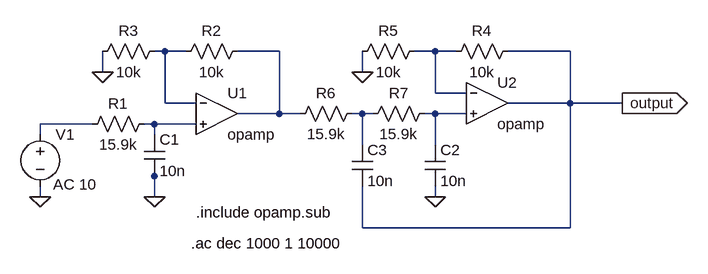
[diagram p0: schematic simulation_ltspice.asc]
simulation_ltspice.asc, the LTspice schematic file:
Version 4.1
SHEET 1 984 680
WIRE 144 -272 128 -272
WIRE 176 -272 144 -272
WIRE 320 -272 256 -272
WIRE 560 -272 528 -272
WIRE 592 -272 560 -272
WIRE 768 -272 672 -272
WIRE 48 -240 48 -272
WIRE 448 -240 448 -272
WIRE 560 -208 560 -272
WIRE 608 -208 560 -208
WIRE 144 -192 144 -272
WIRE 192 -192 144 -192
WIRE 768 -192 768 -272
WIRE 768 -192 672 -192
WIRE 848 -192 768 -192
WIRE 320 -176 320 -272
WIRE 320 -176 256 -176
WIRE 352 -176 320 -176
WIRE 448 -176 432 -176
WIRE 464 -176 448 -176
WIRE 560 -176 544 -176
WIRE 608 -176 560 -176
WIRE 32 -160 -48 -160
WIRE 128 -160 112 -160
WIRE 192 -160 128 -160
WIRE -48 -144 -48 -160
WIRE 128 -144 128 -160
WIRE 448 -128 448 -176
WIRE 560 -128 560 -176
WIRE 128 -80 128 -96
WIRE -48 -48 -48 -64
WIRE 128 -48 128 -80
WIRE 560 -48 560 -64
WIRE 448 0 448 -64
WIRE 768 0 768 -192
WIRE 768 0 448 0
FLAG 48 -240 0
FLAG 128 -48 0
FLAG -48 -48 0
FLAG 560 -48 0
FLAG 448 -240 0
FLAG 848 -192 output
IOPIN 848 -192 Out
SYMBOL OpAmps\\opamp 224 -240 R0
SYMATTR InstName U1
SYMBOL res 128 -176 R90
WINDOW 0 0 56 VBottom 2
WINDOW 3 32 56 VTop 2
SYMATTR InstName R1
SYMATTR Value 15.9k
SYMBOL cap 112 -144 R0
SYMATTR InstName C1
SYMATTR Value 10n
SYMBOL res 272 -288 R90
WINDOW 0 0 56 VBottom 2
WINDOW 3 32 56 VTop 2
SYMATTR InstName R2
SYMATTR Value 10k
SYMBOL res 144 -288 R90
WINDOW 0 0 56 VBottom 2
WINDOW 3 32 56 VTop 2
SYMATTR InstName R3
SYMATTR Value 10k
SYMBOL voltage -48 -160 R0
WINDOW 123 20 93 Left 2
WINDOW 39 0 0 Left 0
SYMATTR InstName V1
SYMATTR Value ""
SYMATTR Value2 AC 10
SYMBOL OpAmps\\opamp 640 -256 R0
SYMATTR InstName U2
SYMBOL res 688 -288 R90
WINDOW 0 0 56 VBottom 2
WINDOW 3 32 56 VTop 2
SYMATTR InstName R4
SYMATTR Value 10k
SYMBOL res 544 -288 R90
WINDOW 0 0 56 VBottom 2
WINDOW 3 32 56 VTop 2
SYMATTR InstName R5
SYMATTR Value 10k
SYMBOL res 448 -192 R90
WINDOW 0 0 56 VBottom 2
WINDOW 3 32 56 VTop 2
SYMATTR InstName R6
SYMATTR Value 15.9k
SYMBOL res 560 -192 R90
WINDOW 0 0 56 VBottom 2
WINDOW 3 32 56 VTop 2
SYMATTR InstName R7
SYMATTR Value 15.9k
SYMBOL cap 544 -128 R0
SYMATTR InstName C2
SYMATTR Value 10n
SYMBOL cap 432 -128 R0
SYMATTR InstName C3
SYMATTR Value 10n
TEXT 184 24 Left 2 !.ac dec 1000 1 10000
TEXT 192 -24 Left 2 !.include opamp.sub

The netlist it stands for:
* simulation_ltspice.asc
X§U1 N001 N007 N002 opamp Aol=100K GBW=10Meg  ; pins invin noninvin out
R1 N007 N006 15.9k
C1 N007 0 10n
R2 N002 N001 10k
R3 N001 0 10k
V1 N006 0 AC 10
X§U2 N003 N005 output opamp Aol=100K GBW=10Meg  ; pins invin noninvin out
R4 output N003 10k
R5 N003 0 10k
R6 N004 N002 15.9k
R7 N005 N004 15.9k
C2 N005 0 10n
C3 N004 output 10n
.ac dec 1000 1 10000
.include opamp.sub
.backanno
.end